# Altium schematic sheet P04 Power1.SchDoc
size 467 x 302 mm
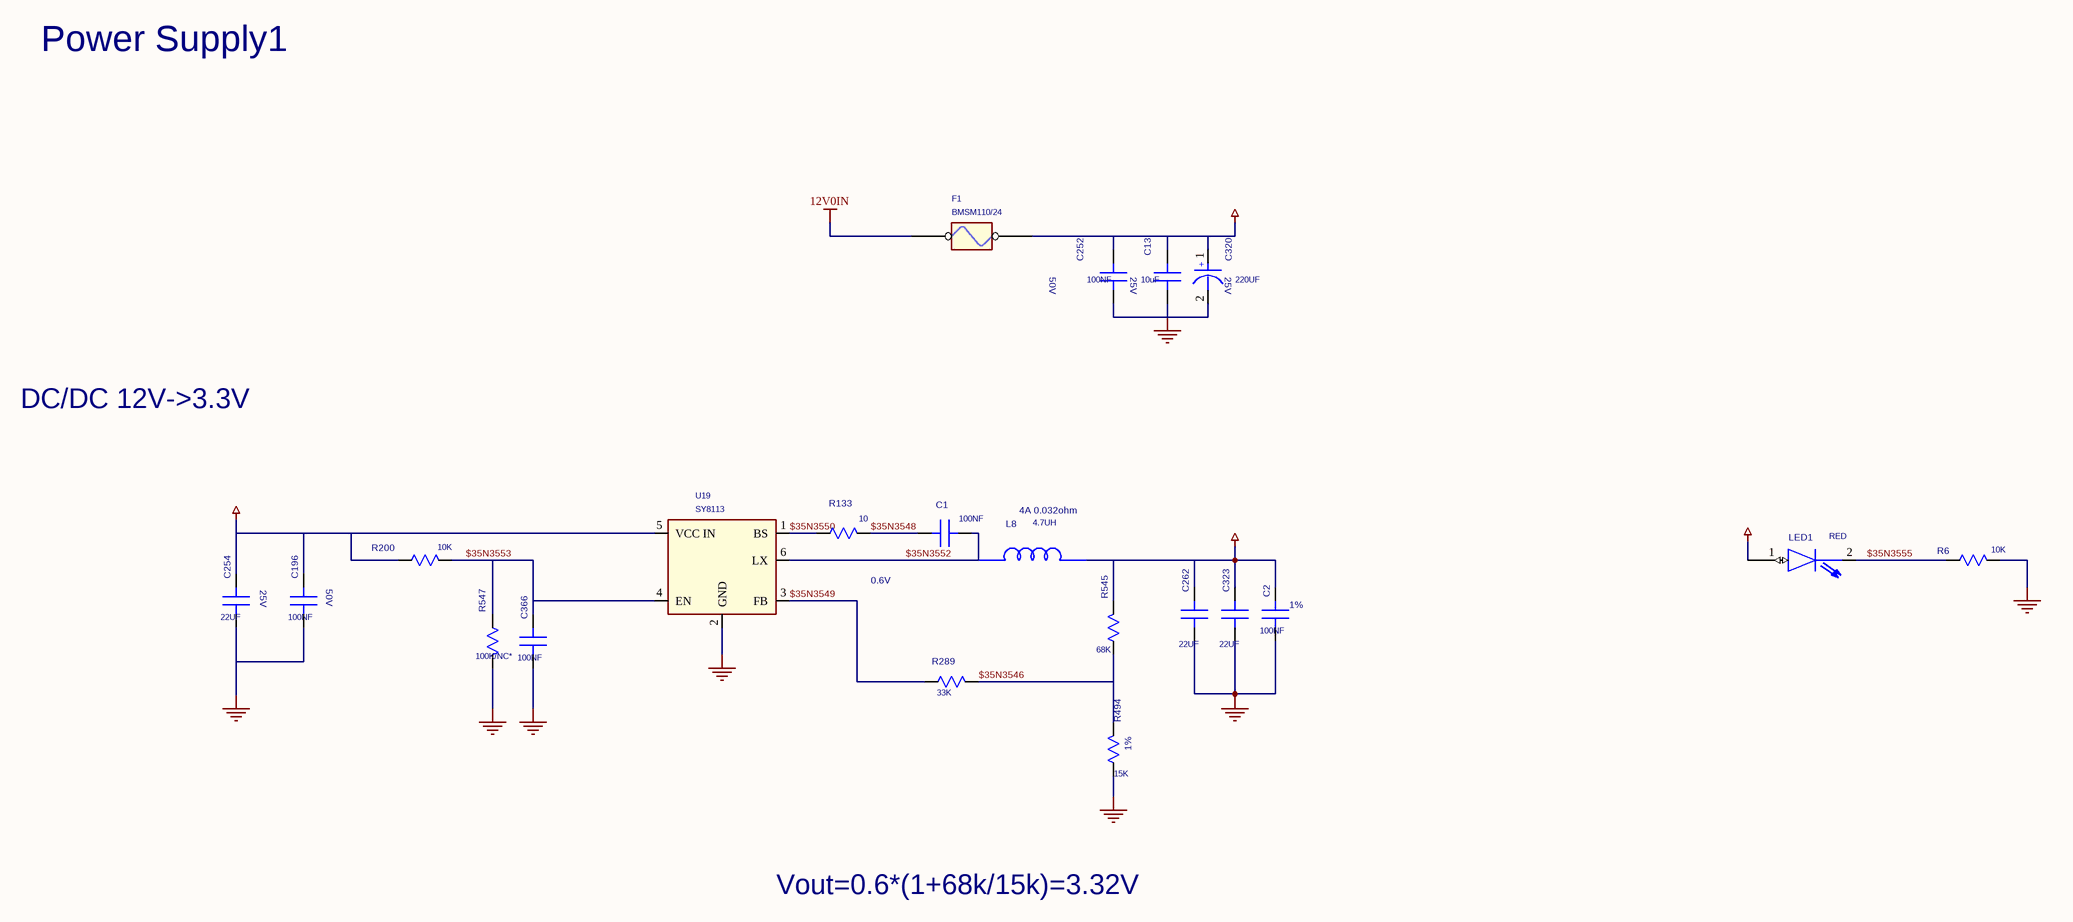
[diagram p0: P04 Power1.SchDoc]

## Parts
C1  100NF  [SC0402]
C2  100NF  [SC0402]
C13  10uF  [SC0805]
C196  100NF  [SC0603]
C252  100NF  [SC0603]
C254  22UF  [SC1210B]
C262  22UF  [SC1206]
C320  220UF  [SCAPC2-280-327]
C323  22UF  [SC1206]
C366  100NF  [SC0603]
F1  BMSM110/24  [1812]
L8  4.7UH  [SL2828]
LED1  RED  [HSD0603-LED]
R6  10K  [SR0603]
R133  10  [SR0402]
R200  10K  [SR0402]
R289  33K  [SR0402]
R494  15K  [SR0402]
R545  68K  [SR0603]
R547  100K/NC*  [SR0402]
U19  SY8113  [SOT23-6]

## Nets
3V3: C2.1(A) C262.1(A) C323.1(A) L8.2(B) LED1.1(A) R545.2(B)
12V0: C13.1(A) C196.1(A) C252.1(A) C254.1(A) C320.1 F1.2 R200.1(A) U19.5(VCC_IN)
12V0IN: F1.1
GND: C2.2(B) C13.2(B) C196.2(B) C252.2(B) C254.2(B) C262.2(B) C320.2 C323.2(B) C366.2(B) R6.2(B) R494.1(A) R547.2(B) U19.2(GND)
$35N3546: R289.2(B) R494.2(B) R545.1(A)
$35N3548: C1.1(A) R133.2(B)
$35N3549: R289.1(A) U19.3(FB)
$35N3550: R133.1(A) U19.1(BS)
$35N3552: C1.2(B) L8.1(A) U19.6(LX)
$35N3553: C366.1(A) R200.2(B) R547.1(A) U19.4(EN)
$35N3555: LED1.2(B) R6.1(A)

## Notes on the sheet
- Power Supply1
- 50V
- (near C252) 25V
- (near C320) 25V
- DC/DC 12V->3.3V
- 4A 0.032ohm
- (near C254) 25V
- (near C196) 50V
- 0.6V
- (near C2) 1%
- (near R494) 1%
- Vout=0.6*(1+68k/15k)=3.32V
- (in symbol CP) +

## Library data of the parts
C1 = C: PARTS: 1; OriginalSymbolOrigin: (0,0); DEVICE: RMEMK105BJ104KV_FR; LEVEL: STD; PINSWAP: (A,B); COMPONENT_HIGH_MAX: 0.55MM; %208%%161%%192%%224%%195%%251%%179%%198%: SMD陶瓷电容; %182%%238%%182%%168%%185%%164%%215%%247%%181%%231%%209%%185%(V): 16; %195%%232%%202%%246%: SMD陶瓷电容-16V-100NF-+/-10%-X7R-0402-BT; CODE: 8070614; PKG_TYPE: SC0402
C2 = C: PARTS: 1; OriginalSymbolOrigin: (0,0); DEVICE: RMEMK105BJ104KV_FR; LEVEL: STD; PINSWAP: (A,B); %208%%161%%192%%224%%195%%251%%179%%198%: SMD陶瓷电容; COMPONENT_HIGH_MAX: 0.55MM; %182%%238%%182%%168%%185%%164%%215%%247%%181%%231%%209%%185%(V): 16; %195%%232%%202%%246%: SMD陶瓷电容-16V-100NF-+/-10%-X7R-0402-BT; CODE: 8070614; PKG_TYPE: SC0402
C13 = C: PARTS: 1; OriginalSymbolOrigin: (0,0); DEVICE: C2012X5R1E106KT000N1; LEVEL: STD; PINSWAP: (A,B); %208%%161%%192%%224%%195%%251%%179%%198%: SMD陶瓷电容; %195%%232%%202%%246%: SMD陶瓷电容-25V-10000NF-+/-20%-X5R-0805; CODE: 8071629; %182%%238%%182%%168%%185%%164%%215%%247%%181%%231%%209%%185%(V): 25; COMPONENT_HIGH_MAX: 1.45MM; PKG_TYPE: SC0805
C196 = C: PARTS: 1; OriginalSymbolOrigin: (0,0); DEVICE: C1608X7R1H104KT000N; LEVEL: STD; PINSWAP: (A,B); %208%%161%%192%%224%%195%%251%%179%%198%: SMD陶瓷电容; COMPONENT_HIGH_MAX: 0.95MM; %182%%238%%182%%168%%185%%164%%215%%247%%181%%231%%209%%185%(V): 50; %195%%232%%202%%246%: SMD陶瓷电容-50V-100NF-+/-10%-X7R-0603; CODE: 8070627; PKG_TYPE: SC0603
C252 = C: PARTS: 1; OriginalSymbolOrigin: (0,0); DEVICE: C1608X7R1H104KT000N; LEVEL: STD; PINSWAP: (A,B); COMPONENT_HIGH_MAX: 0.95MM; %182%%238%%182%%168%%185%%164%%215%%247%%181%%231%%209%%185%(V): 50; CODE: 8070627; %195%%232%%202%%246%: SMD陶瓷电容-50V-100NF-+/-10%-X7R-0603; %208%%161%%192%%224%%195%%251%%179%%198%: SMD陶瓷电容; PKG_TYPE: SC0603
C254 = C: PARTS: 1; OriginalSymbolOrigin: (0,0); DEVICE: CETMK325B7226KM_T; LEVEL: STD; PINSWAP: (A,B); %195%%232%%202%%246%: SMD陶瓷电容-25V-22000NF-+/-10%-X7R-1210-所有; CODE: 8070825; %208%%161%%192%%224%%195%%251%%179%%198%: SMD陶瓷电容; COMPONENT_HIGH_MAX: 2.7MM; %182%%238%%182%%168%%185%%164%%215%%247%%181%%231%%209%%185%(V): 25; PKG_TYPE: SC1210B
C262 = C: PARTS: 1; OriginalSymbolOrigin: (0,0); DEVICE: CEJMK316B7226ML_T; LEVEL: STD; PINSWAP: (A,B); COMPONENT_HIGH_MAX: 1.8mm; %182%%238%%182%%168%%185%%164%%215%%247%%181%%231%%209%%185%(V): 6.3; %195%%232%%202%%246%: SMD陶瓷电容-6.3V-22000nF-+/-20%-X7R-1206-所有; CODE: 8070862; %208%%161%%192%%224%%195%%251%%179%%198%: SMD陶瓷电容; PKG_TYPE: SC1206
C320 = CP: PARTS: 1; OriginalSymbolOrigin: (-10,0); DEVICE: EMVE250ADA221MHA0G; LEVEL: STD; %208%%161%%192%%224%%195%%251%%179%%198%: 非固体SMD铝电容; %195%%232%%202%%246%: 非固体SMD铝电容-25V-220UF-+/-20%-8*10.5-8.3*8.3MM-极性-105DEGC-1000H-SMD-温度敏感器件-工艺耐温250DEGC,5S; CODE: 8120004; %182%%238%%182%%168%%185%%164%%215%%247%%181%%231%%209%%185%(V): 25; COMPONENT_HIGH_MAX: 10.5MM; PKG_TYPE: SCAPC2-280-327
C323 = C: PARTS: 1; OriginalSymbolOrigin: (0,0); DEVICE: CEJMK316B7226ML_T; LEVEL: STD; PINSWAP: (A,B); CODE: 8070862; %182%%238%%182%%168%%185%%164%%215%%247%%181%%231%%209%%185%(V): 6.3; %195%%232%%202%%246%: SMD陶瓷电容-6.3V-22000nF-+/-20%-X7R-1206-所有; COMPONENT_HIGH_MAX: 1.8mm; %208%%161%%192%%224%%195%%251%%179%%198%: SMD陶瓷电容; PKG_TYPE: SC1206
C366 = C: PARTS: 1; OriginalSymbolOrigin: (0,0); DEVICE: C1608X7R1H104KT000N; LEVEL: STD; PINSWAP: (A,B); %182%%238%%182%%168%%185%%164%%215%%247%%181%%231%%209%%185%(V): 50; %195%%232%%202%%246%: SMD陶瓷电容-50V-100NF-+/-10%-X7R-0603; CODE: 8070627; %208%%161%%192%%224%%195%%251%%179%%198%: SMD陶瓷电容; COMPONENT_HIGH_MAX: 0.95MM; PKG_TYPE: SC0603
F1 = FUSEHOLDER
L8 = L: PARTS: 1; DEVICE: TGSDRH6D38_4R7N; LEVEL: STD; OriginalSymbolOrigin: (-20,0); COMPONENT_HIGH_MAX: 4MM; %208%%161%%192%%224%%195%%251%%179%%198%: 贴片电感器; %195%%232%%202%%246%: 贴片电感器-4.7UH-+/-30%-0.032OHM-4A-30DEGC MAX-7.0*7.0*4.0MM-使用温度范围包括电感温升,工艺耐温250DEGC; CODE: 10031094; PKG_TYPE: SL2828
LED1 = LED: PARTS: 1; OriginalSymbolOrigin: (0,0); CODE: 15020150; DEVICE: 19_218_R6C_FM2P1B7Y_3THW; LEVEL: STD; COMPONENT_HIGH_MAX: 0.35MM; %195%%232%%202%%246%: 发光二极管-0.0225CD-红色/630NM-20MA-0603-华技终端专用; %208%%161%%192%%224%%195%%251%%179%%198%: 发光二极管; PKG_TYPE: HSD0603-LED
R6 = R_Dup1: PARTS: 1; OriginalSymbolOrigin: (0,0); PINSWAP: (A,B); DEVICE: RC0603JR_07470R; LEVEL: STD; %208%%161%%192%%224%%195%%251%%179%%198%: 片式厚膜电阻器; COMPONENT_HIGH_MAX: 0.55MM; %215%%232%%214%%181%%212%%202%%208%%237%%198%%171%%178%%238%: +/-5%; %182%%238%%182%%168%%185%%166%%194%%202%(W): 0.1; CODE: 7090275; %195%%232%%202%%246%: 片式厚膜电阻器-0.1W-470OHM-+/-5%-0603; PKG_TYPE: SR0603
R133 = R_Dup1: PARTS: 1; OriginalSymbolOrigin: (0,0); PINSWAP: (A,B); DEVICE: RC_02W100FT; LEVEL: STD; COMPONENT_HIGH_MAX: 0.4mm; %195%%232%%202%%246%: 片式厚膜电阻器-0.0625W-10ohm-+/-1%-0402; CODE: 7091305; %208%%161%%192%%224%%195%%251%%179%%198%: 片式厚膜电阻器; PKG_TYPE: SR0402
R200 = R_Dup1: PARTS: 1; OriginalSymbolOrigin: (0,0); PINSWAP: (A,B); DEVICE: RC_02W103JT; LEVEL: STD; CODE: 7090815; %195%%232%%202%%246%: 片式厚膜电阻器-0.0625W-10000ohm-+/-5%-0402-BT; %182%%238%%182%%168%%185%%166%%194%%202%(W): 0.06; %215%%232%%214%%181%%212%%202%%208%%237%%198%%171%%178%%238%: +/-5%; COMPONENT_HIGH_MAX: 0.4MM; %208%%161%%192%%224%%195%%251%%179%%198%: 片式厚膜电阻器; PKG_TYPE: SR0402
R289 = R_Dup1: PARTS: 1; OriginalSymbolOrigin: (0,0); PINSWAP: (A,B); DEVICE: RK73B1ELTP333J; LEVEL: STD; %208%%161%%192%%224%%195%%251%%179%%198%: 片式厚膜电阻器; COMPONENT_HIGH_MAX: 0.4MM; CODE: 7090828; %195%%232%%202%%246%: 片式厚膜电阻器-0.0625W-33000OHM-+/-5%-0402; %182%%238%%182%%168%%185%%166%%194%%202%(W): 0.06; %215%%232%%214%%181%%212%%202%%208%%237%%198%%171%%178%%238%: +/-5%; PKG_TYPE: SR0402
R494 = R_Dup1: PARTS: 1; OriginalSymbolOrigin: (0,0); PINSWAP: (A,B); DEVICE: RK73H1ETTP1002F; LEVEL: STD; %208%%161%%192%%224%%195%%251%%179%%198%: 片式厚膜电阻器; CODE: 7090867; %195%%232%%202%%246%: 片式厚膜电阻器-0.0625W-10000OHM-+/-1%-0402-BT; COMPONENT_HIGH_MAX: 0.4MM; %215%%232%%214%%181%%212%%202%%208%%237%%198%%171%%178%%238%: +/-1%; %182%%238%%182%%168%%185%%166%%194%%202%(W): 0.06; PKG_TYPE: SR0402
R545 = R_Dup1: PARTS: 1; OriginalSymbolOrigin: (0,0); PINSWAP: (A,B); DEVICE: RC_03K3092FT; LEVEL: STD; %195%%232%%202%%246%: 片式厚膜电阻器-0.1W-30900OHM-+/-1%-0603; CODE: 7090665; %182%%238%%182%%168%%185%%166%%194%%202%(W): 0.1; COMPONENT_HIGH_MAX: 0.55MM; %215%%232%%214%%181%%212%%202%%208%%237%%198%%171%%178%%238%: +/-1%; %208%%161%%192%%224%%195%%251%%179%%198%: 片式厚膜电阻器; PKG_TYPE: SR0603
R547 = R_Dup1: PARTS: 1; OriginalSymbolOrigin: (0,0); PINSWAP: (A,B); DEVICE: RK73H1ETTP1003F; LEVEL: STD; %215%%232%%214%%181%%212%%202%%208%%237%%198%%171%%178%%238%: +/-1%; CODE: 7090875; %195%%232%%202%%246%: 片式厚膜电阻器-0.0625W-100000OHM-+/-1%-0402; COMPONENT_HIGH_MAX: 0.4MM; %208%%161%%192%%224%%195%%251%%179%%198%: 片式厚膜电阻器; %182%%238%%182%%168%%185%%166%%194%%202%(W): 0.06; VARIANT_ID: $35I3604; PKG_TYPE: SR0402
U19 = SY8120